# Altium schematic sheet External_IO_Protection.SchDoc
size A4; CompanyName: Technische Hochschule Nürnberg Georg Simon Ohm; Organization: UltraZohm; Address1: Kesslerplatz 12; Address2: 90489 Nürnberg; Address3: GERMANY; SheetNumber: 20; SheetTotal: 36; Website: www.ultrazohm.com
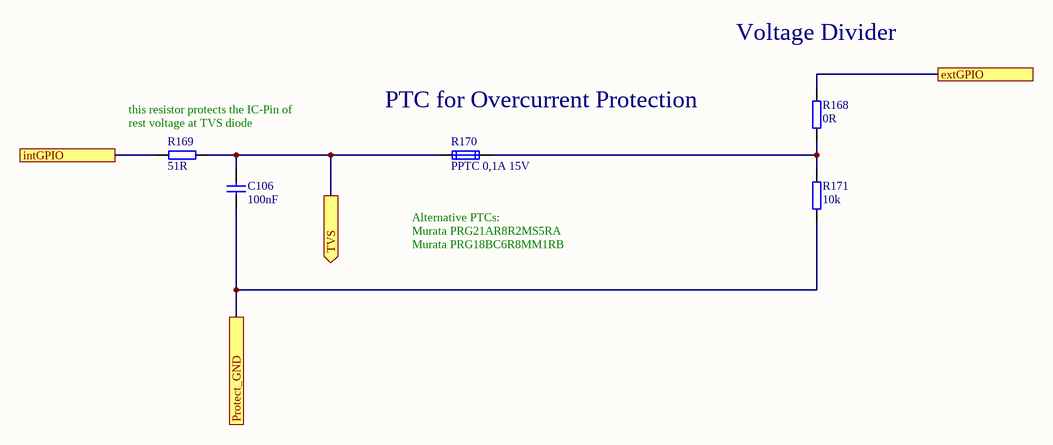
[diagram p0: External_IO_Protection.SchDoc]

## Parts
C106  100nF  [CAPC1608X90N_V]
R168  0R  [R_0603_TE]
R169  51R  [RESC1608X55N_V]
R170  PPTC 0,1A 15V  [RESC2012X85N]
R171  10k  [R_0603_TE]

## Ports
extGPIO, intGPIO, Protect_GND, TVS (out)

## Nets
extGPIO: R168.2 ; port extGPIO
intGPIO: R169.2 ; port intGPIO
Protect_GND: C106.1 R171.2 ; port Protect_GND
TVS: C106.2 R169.1 R170.1 ; port TVS
NetR168_1: R168.1 R170.2 R171.1

## Notes on the sheet
- Voltage Divider
- (near R169) this resistor protects the IC-Pin of rest voltage at TVS diode
- (near R170) PTC for Overcurrent Protection
- Alternative PTCs:
  Murata PRG21AR8R2MS5RA
  Murata PRG18BC6R8MM1RB
- Title
- Revision:
- Design Engineer:
- Date:
- Project:
- Sheet
- of

## Library data of the parts
C106 = 21382: KON 100nF 50V X7R ±10% SMD BF 1608 (0603); Value: 100n; AN: 21382; Mixed: SMT; Preferred: Yes; Temperature-Range: -55/+125; Tolerance: ±10%; Voltage: 50V; Technology: X7R; Case: 1608 (0603)
R168 = UZgen_R_0603_0R: Generic resistor; Manufacturer: UZgen; Tolerance: 1 %; Created from: UZgenTool; Value: 0R; Manufacturer Part Number: UZgen_R_0603_0R; PartID: 581; Created On: 08.07.2024 14:34:30; Device Package: 0603; Mounting Type: SMD; Last Updated: 08.07.2024 14:34:30
R169 = 25938: WID SMD 51R 1% 0,1W  BF 1608 (0603); Value: 51; AN: 25938; Mixed: SMT; Preferred: Yes; Tolerance: 1%; Case: 1608 (0603); Technology: TK100
R170 = 28044: PTC Resettable Fuse 0.1A 15V SMD 0805; AN: 28044; Mixed: SMT; H-ART: MF-PSMF010X-2; Value: 0.1A; HelpURL: B:\AD\adlib\datasheet\MF-PSMF; Case: 2012 (0805); Voltage: 15V; Extra: MF-PSMF010X-2
R171 = UZgen_R_0603_10k: Generic resistor; Manufacturer: UZgen; Tolerance: 1 %; Created from: AGeiger; Value: 10k; Manufacturer Part Number: UZgen_R_0603_10k; PartID: 1; Created On: 02.07.2024 14:34:53; Device Package: 0603; Mounting Type: SMD; Last Updated: 02.07.2024 14:37:16